# Altium schematic sheet TemperatureSensor.SchDoc
size A4
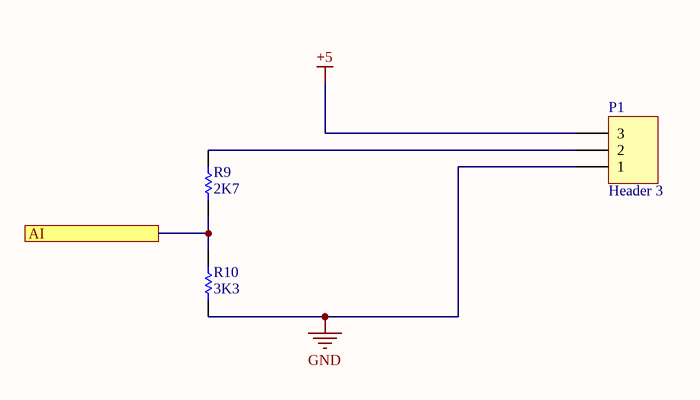
[diagram p0: TemperatureSensor.SchDoc]

## Parts
P1  Header 3  [HDR1X3]
R9  2K7  [RESC0603(1608)_N]
R10  3K3  [RESC0603(1608)_N]

## Ports
AI

## Nets
+5: P1.3
GND: P1.1 R10.1
AI: R9.1 R10.2 ; port AI
NetP1_2: P1.2 R9.2

## Library data of the parts
P1 = Header 3: Header, 3-Pin; LatestRevisionDate: 17-Jul-2002; LatestRevisionNote: Re-released for DXP Platform.; Publisher: Altium Limited
R9 R10 = CMP-1012-00623-1: 10K 0.1W 1% 0603 (1608 Metric)  SMD; Value: 10000.00 Ohm; Case-EIA: 0603; Case-Metric: 1608; Power: 0.1 W; Tolerance: 1 %; Technology: SMT